# EasyEDA Pro project ZeptoWatch.eprj, schematic Schematic1
Create Date: 2022-11-08; Page Name: P1; Project Name: ZeptoWatch; Schematic Name: Schematic1; Update Date: 2022-11-27; Company: 嘉立创EDA; Page Size: A3; Version: V1.0
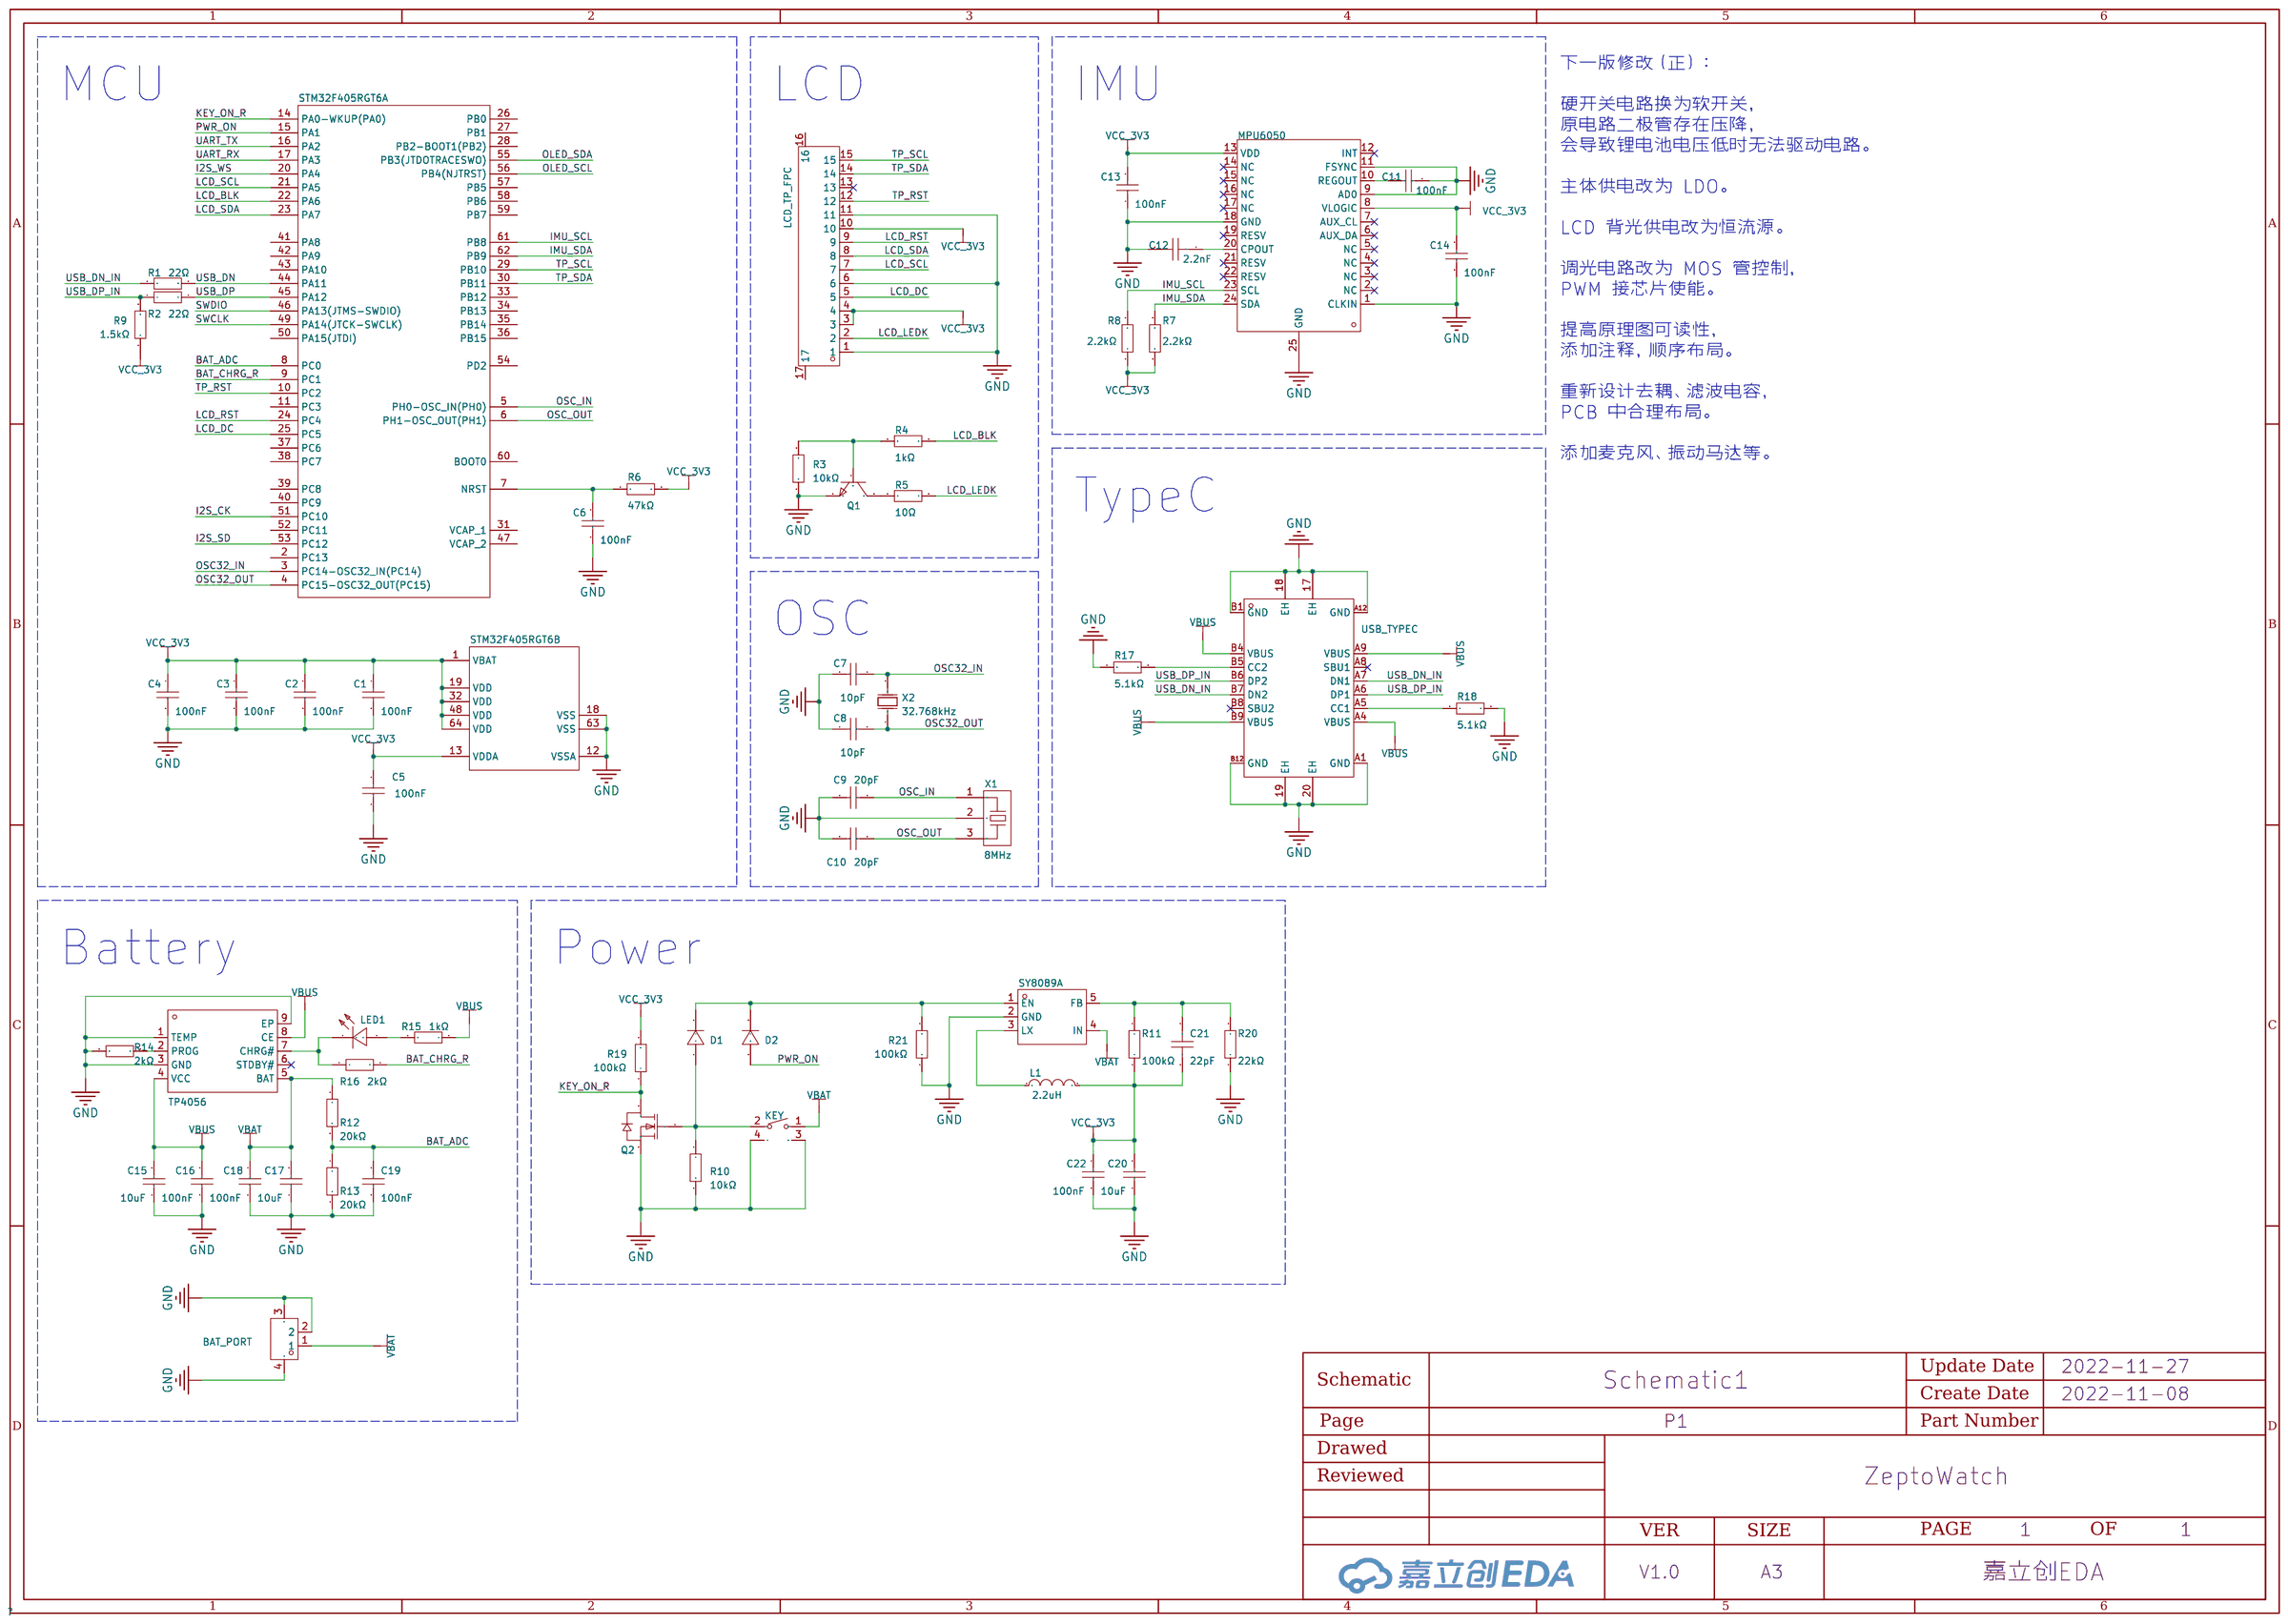
[diagram p0: schematic sheet]

## Parts
BAT_PORT  1.25K-CB-2PWB  [CONN-SMD_2P-P1.25_L5.5-W7.7-2PWB]
C1  100nF  [C0402]
C2  100nF  [C0402]
C3  100nF  [C0402]
C4  100nF  [C0402]
C5  100nF  [C0402]
C6  100nF  [C0402]
C7  10pF  [C0402]
C8  10pF  [C0402]
C9  20pF  [C0402]
C10  20pF  [C0402]
C11  100nF  [C0402]
C12  2.2nF  [C0402]
C13  100nF  [C0402]
C14  100nF  [C0402]
C15  10uF  [C0402]
C16  100nF  [C0402]
C17  10uF  [C0402]
C18  100nF  [C0402]
C19  100nF  [C0402]
C20  10uF  [C0402]
C21  22pF  [C0402]
C22  100nF  [C0402]
D1  B5819WS  [SOD-323_L1.8-W1.3-LS2.5-FD]
D2  B5819WS  [SOD-323_L1.8-W1.3-LS2.5-FD]
KEY  TS-KG012EV  [SW-SMD_TS-KG012EV]
L1  2.2uH  [IND-SMD_L2.5-W2.0_SWPA252012S]
LCD_TP_FPC  KH-FG0.5-H2.0-15PIN  [FPC-SMD_15P-P0.50_KINGHELM_KH-FG0.5-H2.0-15PIN]
LED1  D-060306B1  [LED0603-RD]
MPU6050  MPU-6050  [QFN-24_L4.0-W4.0-P0.50-BL-EP2.7]
Q1  SS8050  [SOT-23-3_L2.9-W1.3-P1.90-LS2.4-BR]
Q2  AO3400A  [SOT-23-3_L2.9-W1.6-P1.90-LS2.8-BR]
R1  22Ω  [R0402]
R2  22Ω  [R0402]
R3  10kΩ  [R0402]
R4  1kΩ  [R0402]
R5  10Ω  [R0402]
R6  47kΩ  [R0402]
R7  2.2kΩ  [R0402]
R8  2.2kΩ  [R0402]
R9  1.5kΩ  [R0402]
R10  10kΩ  [R0402]
R11  100kΩ  [R0402]
R12  20kΩ  [R0402]
R13  20kΩ  [R0402]
R14  2kΩ  [R0402]
R15  1kΩ  [R0402]
R16  2kΩ  [R0402]
R17  5.1kΩ  [R0402]
R18  5.1kΩ  [R0402]
R19  100kΩ  [R0402]
R20  22kΩ  [R0402]
R21  100kΩ  [R0402]
STM32F405RGT6  STM32F405RGT6  [LQFP-64_L10.0-W10.0-P0.50-LS12.0-BL]  (sections 1,2)
SY8089A  SY8089A1AAC  [SOT-23-5_L3.0-W1.7-P0.95-LS2.8-BL]
TP4056  TP4056  [ESOP-8_L4.9-W3.9-P1.27-LS6.0-BL-EP]
USB_TYPEC  TYPE-C-16M-005  [USB-C-SMD_TYPE-C-16M-005]
X1  8MHz  [OSC-SMD_3P-L3.2-W1.3-P1.2-L]
X2  32.768kHz  [OSC-SMD_L3.2-W1.5]

## Library data of the parts
BAT_PORT = 1.25K-CB-2PWB: 参考系列:-;间距:1.25mm;插针结构:1x2P;排数:1;每排PIN数:2;行距:-;公母:公型插针;安装方式:卧贴;额定电流:1A;工作温度范围:-25~+85;; LCSC Part Name: 1x2P 间距P=1.25mm 超薄针座 超薄; Supplier Part: C2919570; Manufacturer: HDGC(华德共创); Supplier Footprint: SMD,P=1.25mm; JLCPCB Part Class: 扩展库; Datasheet: https://atta.szlcsc.com/upload/public/pdf/source/20211115/F776F48743F73668B48ED2809AC4027A.pdf; Supplier: LCSC; Pitch: 1.25mm; Pins Structure: 1x2P; Number of Rows: 1; Number of PINs Per Row: 2; Gender: 公型插针; Mounting Style: 卧贴; Current Rating (Max): 1A; Operating Temperature Range: -25~+85
C1-C6 C11 C13 C14 C16 C18 C19 C22 = CC0402KRX7R9BB104: 容值:100nF;精度:±10%;额定电压:50V;材质(温度系数):X7R;; LCSC Part Name: 100nF ±10% 50V; Supplier Part: C131394; Manufacturer: YAGEO(国巨); Supplier Footprint: 0402; JLCPCB Part Class: 扩展库; Datasheet: https://atta.szlcsc.com/upload/public/pdf/source/20170925/C131394_1506321459057990237.pdf; Supplier: LCSC; Tolerance: ±10%; Voltage Rated: 50V; Temperature Coefficient: X7R
C7 C8 = 0402CG100J500NT: 容值:10pF;精度:±5%;额定电压:50V;材质(温度系数):C0G;; LCSC Part Name: 10pF ±5% 50V; Supplier Part: C1545; Manufacturer: FH(风华); Supplier Footprint: 0402; JLCPCB Part Class: 扩展库; Datasheet: https://atta.szlcsc.com/upload/public/pdf/source/20170923/C1545_1506149264855988352.pdf; Supplier: LCSC; Tolerance: ±5%; Voltage Rated: 50V; Temperature Coefficient: C0G
C9 C10 = 0402CG200J500NT: 温度系数:C0G;容值:20pF;精度:±5%;额定电压:50V;; LCSC Part Name: 20pF(200) ±5% 50V; Supplier Part: C1554; Manufacturer: FH(风华); Supplier Footprint: 0402; JLCPCB Part Class: 基础库; Datasheet: https://atta.szlcsc.com/upload/public/pdf/source/20170923/C1554_1506149268708988361.pdf; Supplier: LCSC; Temperature Coefficient: C0G; Tolerance: ±5%; Voltage Rated: 50V
C12 = CC0402JRX7R9BB222: 温度系数:X7R;容值:2.2nF;电容体长:-;电容体宽:-;电容体厚度:-;精度:±5%;额定电压:50V;; LCSC Part Name: 2.2nF ±5% 50V; Supplier Part: C513667; Manufacturer: YAGEO(国巨); Supplier Footprint: 0402; JLCPCB Part Class: 扩展库; Datasheet: https://atta.szlcsc.com/upload/public/pdf/source/20200415/C513667_43ACA5E3BCCDD816EC65E9B61132137F.pdf; Supplier: LCSC; Temperature Coefficient: X7R; Tolerance: ±5%; Voltage Rated: 50V
C15 C17 C20 = CL05A106MQ5NUNC: 容值:10uF;精度:±20%;额定电压:6.3V;材质(温度系数):X5R;; LCSC Part Name: 10uF ±20% 6.3V; Supplier Part: C15525; Manufacturer: SAMSUNG(三星); Supplier Footprint: 0402; JLCPCB Part Class: 基础库; Datasheet: https://atta.szlcsc.com/upload/public/pdf/source/20220823/2B02EE04F8F211D38A52DCB16EB6BEBA.pdf; Supplier: LCSC; Tolerance: ±20%; Voltage Rated: 6.3V; Temperature Coefficient: X5R
C21 = CC0402GRNPO9BN220: 容值:22pF;精度:±2%;额定电压:50V;温度系数:NP0;; LCSC Part Name: 22pF ±2% 50V; Supplier Part: C541412; Manufacturer: YAGEO(国巨); Supplier Footprint: 0402; JLCPCB Part Class: 扩展库; Datasheet: https://atta.szlcsc.com/upload/public/pdf/source/20200615/C541412_C69BCDCF7FD3EA2053A0CD1B14797F17.pdf; Supplier: LCSC; Tolerance: ±2%; Voltage Rated: 50V; Temperature Coefficient: NP0
D1 D2 = B5819WS_C511873: 直流反向耐压(Vr):40V;平均整流电流(Io):1A;正向压降(Vf):900mV@3A;; LCSC Part Name: 40V 1A 900mV@3A; Supplier Part: C511873; Manufacturer: BORN伯恩半导体; Supplier Footprint: SOD-323; JLCPCB Part Class: 扩展库; Datasheet: https://atta.szlcsc.com/upload/public/pdf/source/20200413/C511871_84C991E4F87F9BC6B00A967897FF2061.pdf; Supplier: LCSC; Reverse Voltage (Vr): 40V; Average Rectified Current (Io): 1A; Forward Voltage (Vf@If): 900mV@3A
KEY = TS-KG012EV: 触点电流:50mA;额定电压(DC):12V;绝缘电阻:100MΩ;电路结构:单刀单掷;安装方式:卧插;按钮形状:矩形按钮;带灯:-;; LCSC Part Name: 轻触开关3*6*3.5侧按卧式 带柱; Supplier Part: C410363; Manufacturer: HANBO(汉博); Supplier Footprint: 插件,7.8x3.6x3.5mm; JLCPCB Part Class: 扩展库; Datasheet: https://atta.szlcsc.com/upload/public/pdf/source/20221110/2C1BC81D53AC7E4C4CC26C5BC87C8C3B.pdf; Supplier: LCSC; Contact Current: 50mA; Voltage Rating (DC): 12V; Insulation Resistance: 100MΩ; Circuit: 单刀单掷; Mounting Style: 卧插; Actuator Style: 矩形按钮
L1 = SWPA252012S2R2NT: 电感值:2.2uH;精度:±30%;额定电流:1.3A;直流电阻(DCR):153mΩ;; LCSC Part Name: 2.2uH ±30% 1.3A 153mΩ; Supplier Part: C36400; Manufacturer: Sunlord(顺络); Supplier Footprint: SMD; JLCPCB Part Class: 扩展库; Datasheet: https://atta.szlcsc.com/upload/public/pdf/source/20210916/AC798BA7E846B7D0B6818F45CD84DB0B.pdf; Supplier: LCSC; Tolerance: ±30%; Rated Current: 1.3A; DC Resistance (DCR): 153mΩ
LCD_TP_FPC = KH-FG0.5-H2.0-15PIN: 间距:0.5mm;触点数量:15;锁定特性:翻盖式;安装类型:卧贴;触点类型:下接;工作温度范围:-25~+85;; LCSC Part Name: 0.5mm P数:15 翻盖式 下接; Supplier Part: C2925370; Manufacturer: kinghelm(金航标); Supplier Footprint: SMD,P=0.5mm; JLCPCB Part Class: 扩展库; Datasheet: https://atta.szlcsc.com/upload/public/pdf/source/20211126/ADAA9B198F87BAF60DF8D38208290934.pdf; Supplier: LCSC; Pitch: 0.5mm; Number of Contacts: 15; Locking Feature: 翻盖式; Mounting Type: 卧贴; Contact Type: 下接; Height Above Board: 2mm; FFC, FCB Thickness: 0.3mm; Operating Temperature Range: -25~+85
LED1 = D-060306B1: 发光颜色:蓝灯;; LCSC Part Name: 蓝色; Supplier Part: C118339; Manufacturer: 方舟 ARKLED; Supplier Footprint: 0603; JLCPCB Part Class: 扩展库; Datasheet: https://atta.szlcsc.com/upload/public/pdf/source/20190902/C118339_0F376D9FE53277D0A68A27C8339FB377.pdf; Supplier: LCSC; Emitted Color: 蓝灯
MPU6050 = MPU-6050: 三轴加速度计和三轴陀螺仪，工作电压：2.375V~3.46V; Supplier Part: C24112; Manufacturer: TDK InvenSense(应美盛); Supplier Footprint: QFN-24_4x4x05P; JLCPCB Part Class: 扩展库; Datasheet: https://atta.szlcsc.com/upload/public/pdf/source/20140425/1457707046159.pdf; Supplier: LCSC
Q1 = SS8050_C2150: 晶体管类型:NPN;集射极击穿电压(Vceo):25V;集电极电流(Ic):1.5A;功率(Pd):300mW;集电极-发射极饱和电压(VCE(sat)@Ic,Ib):500mV@800mA,80mA;直流电流增益(hFE@Ic,Vce):200@100mA,1V;特征频率(fT):100MHz;工作温度:+150@(Tj);; LCSC Part Name: SS8050 Y1 200-350 Y1 200-350; Supplier Part: C2150; Manufacturer: CJ(江苏长电/长晶); Supplier Footprint: SOT-23(SOT-23-3); JLCPCB Part Class: 基础库; Datasheet: https://atta.szlcsc.com/upload/public/pdf/source/20140809/1457707209319.pdf; Supplier: LCSC; Transistor Type: NPN; Collector-Emitter Breakdown Voltage (Vceo): 25V; Collector Current (Ic): 1.5A; Power Dissipation (Pd): 300mW; Collector-Emitter Saturation Voltage (VCE(sat)@Ic,Ib): 500mV@800mA,80mA; DC Current Gain (hFE@Ic,Vce): 200@100mA,1V; Transition Frequency (fT): 100MHz; Operating Temperature: +150@(Tj)
Q2 = AO3400A_C20917: 类型:N沟道;漏源电压(Vdss):30V;连续漏极电流(Id):5.7A;功率(Pd):1.4W;导通电阻(RDS(on)@Vgs,Id):26.5mΩ@10V,5.7A;阈值电压(Vgs(th)@Id):1.5V@250A;; LCSC Part Name: N沟道 30V 5.7A; Supplier Part: C20917; Manufacturer: AOS; Supplier Footprint: SOT-23-3L; JLCPCB Part Class: 基础库; Datasheet: https://atta.szlcsc.com/upload/public/pdf/source/20140107/1457706668533.pdf; Supplier: LCSC; Type: N沟道; Drain Source Voltage (Vdss): 30V; Continuous Drain Current (Id): 5.7A; Power Dissipation (Pd): 1.4W; Drain Source On Resistance (RDS(on)@Vgs,Id): 26.5mΩ@10V,5.7A; Gate Threshold Voltage (Vgs(th)@Id): 1.5V@250A
R1 R2 = CR0402FF22R0G: 电阻类型:厚膜电阻;阻值:22Ω;精度:±1%;功率:1/16W;温度系数:±200ppm/;最大工作电压:50V;工作温度范围:-55~+125;; LCSC Part Name: 22Ω ±1%; Supplier Part: C100318; Manufacturer: LIZ(丽智电子); Supplier Footprint: 0402; Datasheet: https://atta.szlcsc.com/upload/public/pdf/source/20170408/1491621411980.pdf; Supplier: LCSC; Type: 厚膜电阻; Tolerance: ±1%; Power(Watts): 1/16W; Temperature Coefficient: ±200ppm/; Overload Voltage (Max): 50V; Operating Temperature Range: -55~+125
R3 R10 = 0402WGF1002TCE: 电阻类型:厚膜电阻;阻值:10kΩ;精度:±1%;功率:62.5mW;温度系数:±100ppm/;最大工作电压:50V;工作温度范围:-55~+155;; LCSC Part Name: 10kΩ ±1% 62.5mW; Supplier Part: C25744; Manufacturer: UNI-ROYAL(厚声); Supplier Footprint: 0402; JLCPCB Part Class: 基础库; Datasheet: https://atta.szlcsc.com/upload/public/pdf/source/20200306/C422600_1E6D84923E4A46A82E41ADD87F860B5C.pdf; Supplier: LCSC; Type: 厚膜电阻; Tolerance: ±1%; Power(Watts): 62.5mW; Temperature Coefficient: ±100ppm/; Overload Voltage (Max): 50V; Operating Temperature Range: -55~+155
R4 R15 = 0402WGF1001TCE: 电阻类型:厚膜电阻;阻值:1kΩ;精度:±1%;功率:62.5mW;温度系数:±100ppm/;最大工作电压:50V;工作温度范围:-55~+155;; LCSC Part Name: 1kΩ ±1% 62.5mW; Supplier Part: C11702; Manufacturer: UNI-ROYAL(厚声); Supplier Footprint: 0402; JLCPCB Part Class: 基础库; Datasheet: https://atta.szlcsc.com/upload/public/pdf/source/20200306/C422600_1E6D84923E4A46A82E41ADD87F860B5C.pdf; Supplier: LCSC; Type: 厚膜电阻; Tolerance: ±1%; Power(Watts): 62.5mW; Temperature Coefficient: ±100ppm/; Overload Voltage (Max): 50V; Operating Temperature Range: -55~+155
R5 = 0402WGF100JTCE: 精度:±1%;温度系数:±200ppm/;功率:1/16W;阻值:10Ω;最大工作电压:50V;工作温度范围:-55~+155;; LCSC Part Name: 10Ω ±1%; Supplier Part: C25077; Manufacturer: UNI-ROYAL(厚声); Supplier Footprint: 0402; JLCPCB Part Class: 基础库; Datasheet: https://atta.szlcsc.com/upload/public/pdf/source/20170920/C25077_1505901198079982708.pdf; Supplier: LCSC; Tolerance: ±1%; Temperature Coefficient: ±200ppm/; Power(Watts): 1/16W; Overload Voltage (Max): 50V; Operating Temperature Range: -55~+155
R6 = 0402WGF4702TCE: 电阻类型:厚膜电阻;阻值:47kΩ;精度:±1%;功率:62.5mW;温度系数:±100ppm/;最大工作电压:50V;工作温度范围:-55~+155;; LCSC Part Name: 47kΩ ±1% 62.5mW; Supplier Part: C25792; Manufacturer: UNI-ROYAL(厚声); Supplier Footprint: 0402; JLCPCB Part Class: 基础库; Datasheet: https://atta.szlcsc.com/upload/public/pdf/source/20200306/C422600_1E6D84923E4A46A82E41ADD87F860B5C.pdf; Supplier: LCSC; Type: 厚膜电阻; Tolerance: ±1%; Power(Watts): 62.5mW; Temperature Coefficient: ±100ppm/; Overload Voltage (Max): 50V; Operating Temperature Range: -55~+155
R7 R8 = RMC04022.2K5%N: 阻值:2.2kΩ;精度:±5%;功率:1/16W;; LCSC Part Name: 2.2kΩ ±5%; Supplier Part: C269678; Manufacturer: Tyohm(幸亚电阻); Supplier Footprint: 0402; JLCPCB Part Class: 扩展库; Datasheet: https://atta.szlcsc.com/upload/public/pdf/source/20190115/C269678_CFD168C224D6BF2B41E71AA235945392.pdf; Supplier: LCSC; Tolerance: ±5%; Power(Watts): 1/16W
R9 = 0402WGF1501TCE: 阻值:1.5kΩ;精度:±1%;功率:1/16W;温度系数:±100ppm/;最大工作电压:50V;工作温度范围:-55~+155;; LCSC Part Name: 1.5KΩ ±1%; Supplier Part: C25867; Manufacturer: UNI-ROYAL(厚声); Supplier Footprint: 0402; JLCPCB Part Class: 基础库; Datasheet: https://atta.szlcsc.com/upload/public/pdf/source/20170920/C25867_1505895090394980874.pdf; Supplier: LCSC; Tolerance: ±1%; Power(Watts): 1/16W; Temperature Coefficient: ±100ppm/; Overload Voltage (Max): 50V; Operating Temperature Range: -55~+155
R11 R19 R21 = AC0402FR-07100KL: 电阻类型:厚膜电阻;阻值:100kΩ;精度:±1%;功率:62.5mW;温度系数:±100ppm/;最大工作电压:50V;工作温度范围:-55~+155;; LCSC Part Name: 100kΩ ±1%; Supplier Part: C144809; Manufacturer: YAGEO(国巨); Supplier Footprint: 0402; JLCPCB Part Class: 扩展库; Datasheet: https://atta.szlcsc.com/upload/public/pdf/source/20171225/C144809_15141880836601203001.pdf; Supplier: LCSC; Type: 厚膜电阻; Tolerance: ±1%; Power(Watts): 62.5mW; Temperature Coefficient: ±100ppm/; Overload Voltage (Max): 50V; Operating Temperature Range: -55~+155
R12 R13 = RC-02W203JT: 阻值:20kΩ;精度:±5%;功率:62.5mW;温度系数:±200ppm/;最大工作电压:50V;工作温度范围:-55~+155;; LCSC Part Name: 20kΩ ±5% 62.5mW; Supplier Part: C258120; Manufacturer: FH(风华); Supplier Footprint: 0402; JLCPCB Part Class: 扩展库; Datasheet: https://atta.szlcsc.com/upload/public/pdf/source/20180730/C258120_EB2ABA5B79561D80B536831B08AD21D8.pdf; Supplier: LCSC; Tolerance: ±5%; Power(Watts): 62.5mW; Temperature Coefficient: ±200ppm/; Overload Voltage (Max): 50V; Operating Temperature Range: -55~+155
R14 R16 = WR04X202JTL: 精度:±5%;阻值:2kΩ;功率:1/16W;温度系数:±100ppm/;最大工作电压:50V;工作温度范围:-55~+155;; LCSC Part Name: 2kΩ ±5%; Supplier Part: C168256; Manufacturer: Walsin(华新科); Supplier Footprint: 0402; JLCPCB Part Class: 扩展库; Datasheet: https://atta.szlcsc.com/upload/public/pdf/source/20180228/C168256_15198055032591377457.pdf; Supplier: LCSC; Tolerance: ±5%; Power(Watts): 1/16W; Temperature Coefficient: ±100ppm/; Overload Voltage (Max): 50V; Operating Temperature Range: -55~+155
R17 R18 = RC0402FR-075K1L: 阻值:5.1kΩ;精度:±1%;功率:62.5mW;温度系数:±100ppm/;最大工作电压:50V;工作温度范围:-55~+155;; LCSC Part Name: 5.1kΩ ±1% 62.5mW; Supplier Part: C105872; Manufacturer: YAGEO(国巨); Supplier Footprint: 0402; JLCPCB Part Class: 扩展库; Datasheet: https://atta.szlcsc.com/upload/public/pdf/source/20170912/C105872_1505207464555963229.pdf; Supplier: LCSC; Tolerance: ±1%; Power(Watts): 62.5mW; Temperature Coefficient: ±100ppm/; Overload Voltage (Max): 50V; Operating Temperature Range: -55~+155
R20 = AC0402FR-0722KL: 电阻类型:厚膜电阻;阻值:22kΩ;精度:±1%;功率:62.5mW;温度系数:±100ppm/;最大工作电压:50V;工作温度范围:-55~+155;; LCSC Part Name: 22kΩ ±1%; Supplier Part: C144778; Manufacturer: YAGEO(国巨); Supplier Footprint: 0402; JLCPCB Part Class: 扩展库; Datasheet: https://atta.szlcsc.com/upload/public/pdf/source/20171221/C144778_15138311752841195398.pdf; Supplier: LCSC; Type: 厚膜电阻; Tolerance: ±1%; Power(Watts): 62.5mW; Temperature Coefficient: ±100ppm/; Overload Voltage (Max): 50V; Operating Temperature Range: -55~+155
STM32F405RGT6 = STM32F405RGT6: 主频（MAX):168MHz;工作电压:1.8V ~ 3.6V;; Supplier Part: C15742; Manufacturer: ST(意法半导体); Supplier Footprint: LQFP-64_10x10x05P; JLCPCB Part Class: 扩展库; Datasheet: https://atta.szlcsc.com/upload/public/pdf/source/20140724/1457707160365.pdf; Supplier: LCSC; Speed: 168MHz; Voltage - Supply (Vcc/Vdd): 1.8V ~ 3.6V; Program Memory Size: 1MB; RAM Size: 192KB; Number of I/O: 51; A/D: 16x12bit; D/A: 2x12bit; PWM: 56; LCD: MOTOROLA 6800 AND INTEL  8080 TYPE LCD DIRECTLY; UART/USART: 4 USART+2 UART; SPI: 3; I2C（SMBUS/PMBUS）: 3; USB Device: 1; USB Host/OTG: 1; CAN: 2
SY8089A = SY8089A1AAC: Supplier Part: C479074; Manufacturer: 矽力杰silergy; Supplier Footprint: SOT-23-5; JLCPCB Part Class: 扩展库; Datasheet: https://atta.szlcsc.com/upload/public/pdf/source/20200117/C479074_09E605B8BDE11DB5A08573B7E6429A0D.pdf; Supplier: LCSC
TP4056 = TP4056_C382139: LCSC Part Name: 1A锂电池充电IC; Supplier Part: C382139; Manufacturer: TPOWER(天源); Supplier Footprint: ESOP-8; JLCPCB Part Class: 扩展库; Datasheet: https://atta.szlcsc.com/upload/public/pdf/source/20190327/C382139_EC85960E6FE3E26856C240C81751A184.pdf; Supplier: LCSC
USB_TYPEC = TYPE-C-16M-005: 连接器类型:-;标准:-;公母:-;触点数量:-;端口数量:-;安装方式:-;额定电流 - 电源:-;触头材质:-;触头镀层:-;工作温度范围:-;; Supplier Part: C2798173; Manufacturer: USAKRO(美韩); Supplier Footprint: SMD; Datasheet: https://atta.szlcsc.com/upload/public/pdf/source/20210415/C2798173_AFB22F19D04D65557371BF612B0225CF.pdf; Supplier: LCSC
X1 = CSTCE8M00G15C99-R0: 频率:8MHz;频率容差:±0.1%;内藏负载电容:33pF;谐振阻抗:40Ω;; LCSC Part Name: 8M ±0.1% 33pF; Supplier Part: C110614; Manufacturer: muRata(村田); Supplier Footprint: SMD3213-3P; JLCPCB Part Class: 扩展库; Datasheet: https://atta.szlcsc.com/upload/public/pdf/source/20180327/C110614_9F5031E08ADB10DE4472527BF78A8CAF.pdf; Supplier: LCSC; Frequency Stability: ±0.13%; Frequency Tolerance: ±0.1%; Built-in Load Capacitance: 33pF; Resonant Impedance: 40Ω; Operating Temperature: -40~+125
X2 = X1A000141000300: 晶振类型:贴片无源晶振;频率:32.768kHz;频率公差:±20ppm;负载电容:12.5pF;等效串联电阻(ESR):-;工作温度:-40~+85;; LCSC Part Name: 32.768kHz ±20ppm 12.5pF; Supplier Part: C94276; Manufacturer: EPSON(爱普生); Supplier Footprint: SMD3215-2P; JLCPCB Part Class: 扩展库; Datasheet: https://atta.szlcsc.com/upload/public/pdf/source/20190322/C94276_5F77F140A1A8611EFF35496F1E5C1546.pdf; Supplier: LCSC; Crystal Type: 贴片无源晶振; Frequency Tolerance: ±20ppm; Load Capacitance: 12.5pF; Operating Temperature: -40~+85

## Nets
GND: BAT_PORT.2 BAT_PORT.3 BAT_PORT.4 C1.2 C2.2 C3.2 C4.2 C5.1 C6.1 C7.1 C8.1 C9.1 C10.1 C11.2 C12.2 C13.1 C14.1 C15.1 C16.2 C17.1 C18.2 C19.2 C20.1 C22.2 KEY.3 KEY.4 LCD_TP_FPC.1 LCD_TP_FPC.6 LCD_TP_FPC.11 MPU6050.1(CLKIN) MPU6050.9(AD0) MPU6050.11(FSYNC) MPU6050.18(GND) MPU6050.25(GND) Q1.2(E) Q2.2(S) R3.2 R10.2 R13.2 R14.1 R17.1 R18.2 R20.1 R21.1 STM32F405RGT6.12(VSSA) STM32F405RGT6.18(VSS) STM32F405RGT6.63(VSS) SY8089A.2(GND) TP4056.1(TEMP) TP4056.3(GND) TP4056.9(EP) USB_TYPEC.17(EH) USB_TYPEC.18(EH) USB_TYPEC.19(EH) USB_TYPEC.20(EH) USB_TYPEC.A1(GND) USB_TYPEC.A12(GND) USB_TYPEC.B1(GND) USB_TYPEC.B12(GND) X1.2
VBAT: BAT_PORT.1 C17.2 C18.1 KEY.1 R12.1 SY8089A.4(IN) TP4056.5(BAT)
VBUS: C15.2 C16.1 R15.1 TP4056.4(VCC) TP4056.8(CE) USB_TYPEC.A4(VBUS) USB_TYPEC.A9(VBUS) USB_TYPEC.B4(VBUS) USB_TYPEC.B9(VBUS)
VCC_3V3: C1.1 C2.1 C3.1 C4.1 C5.2 C13.2 C14.2 C20.2 C21.1 C22.1 L1.2 LCD_TP_FPC.3 LCD_TP_FPC.4 LCD_TP_FPC.10 MPU6050.8(VLOGIC) MPU6050.13(VDD) R6.2 R7.1 R8.1 R9.1 R11.1 R19.2 STM32F405RGT6.1(VBAT) STM32F405RGT6.13(VDDA) STM32F405RGT6.19(VDD) STM32F405RGT6.32(VDD) STM32F405RGT6.48(VDD) STM32F405RGT6.64(VDD)
BAT_ADC: C19.1 R12.2 R13.1 STM32F405RGT6.8(PC0)
BAT_CHRG_R: R16.2 STM32F405RGT6.9(PC1)
I2S_CK: STM32F405RGT6.51(PC10)
I2S_SD: STM32F405RGT6.53(PC12)
I2S_WS: STM32F405RGT6.20(PA4)
IMU_SCL: MPU6050.23(SCL) R8.2 STM32F405RGT6.61(PB8)
IMU_SDA: MPU6050.24(SDA) R7.2 STM32F405RGT6.62(PB9)
KEY_ON_R: Q2.3(D) R19.1 STM32F405RGT6.14(PA0-WKUP(PA0))
LCD_BLK: R4.1 STM32F405RGT6.22(PA6)
LCD_DC: LCD_TP_FPC.5 STM32F405RGT6.25(PC5)
LCD_LEDK: LCD_TP_FPC.2 R5.2
LCD_RST: LCD_TP_FPC.9 STM32F405RGT6.24(PC4)
LCD_SCL: LCD_TP_FPC.7 STM32F405RGT6.21(PA5)
LCD_SDA: LCD_TP_FPC.8 STM32F405RGT6.23(PA7)
OLED_SCL: STM32F405RGT6.56(PB4(NJTRST))
OLED_SDA: STM32F405RGT6.55(PB3(JTDOTRACESWO))
OSC32_IN: C7.2 STM32F405RGT6.3(PC14-OSC32_IN(PC14)) X2.2(OSC2)
OSC32_OUT: C8.2 STM32F405RGT6.4(PC15-OSC32_OUT(PC15)) X2.1(OSC1)
OSC_IN: C9.2 STM32F405RGT6.5(PH0-OSC_IN(PH0)) X1.1
OSC_OUT: C10.2 STM32F405RGT6.6(PH1-OSC_OUT(PH1)) X1.3
PWR_ON: D2.1(A) STM32F405RGT6.15(PA1)
SWCLK: STM32F405RGT6.49(PA14(JTCK-SWCLK))
SWDIO: STM32F405RGT6.46(PA13(JTMS-SWDIO))
TP_RST: LCD_TP_FPC.12 STM32F405RGT6.10(PC2)
TP_SCL: LCD_TP_FPC.15 STM32F405RGT6.29(PB10)
TP_SDA: LCD_TP_FPC.14 STM32F405RGT6.30(PB11)
UART_RX: STM32F405RGT6.17(PA3)
UART_TX: STM32F405RGT6.16(PA2)
USB_DN: R1.2 STM32F405RGT6.44(PA11)
USB_DN_IN: R1.1 USB_TYPEC.A7(DN1) USB_TYPEC.B7(DN2)
USB_DP: R2.2 STM32F405RGT6.45(PA12)
USB_DP_IN: R2.1 R9.2 USB_TYPEC.A6(DP1) USB_TYPEC.B6(DP2)
$1N9238: Q1.3(C) R5.1
$1N9425: Q1.1(B) R3.1 R4.2
$1N15962: C11.1 MPU6050.10(REGOUT)
$1N17008: C12.1 MPU6050.20(CPOUT)
$1N32778: R14.2 TP4056.2(PROG)
$1N37022: LED1.2 R15.2
$1N38725: LED1.1 R16.1 TP4056.7(CHRG#)
$1N43806: R17.2 USB_TYPEC.B5(CC2)
$1N44125: R18.1 USB_TYPEC.A5(CC1)
$1N53709: D1.1(A) KEY.2 Q2.1(G) R10.1
$1N56463: D1.2(K) D2.2(K) R21.2 SY8089A.1(EN)
$1N59957: L1.1 SY8089A.3(LX)
$1N60626: C21.2 R11.2 R20.2 SY8089A.5(FB)
Net-(C6-2): C6.2 R6.1 STM32F405RGT6.7(NRST)

Not connected (* = marked no-connect by the designer): LCD_TP_FPC 13* 16 17; MPU6050 2(NC)* 3(NC)* 4(NC)* 5(NC)* 6(AUX_DA)* 7(AUX_CL)* 12(INT)* 14(NC)* 15(NC)* 16(NC)* 17(NC)* 19(RESV)* 21(RESV)* 22(RESV)*; STM32F405RGT6 2(PC13) 11(PC3) 26(PB0) 27(PB1) 28(PB2-BOOT1(PB2)) 31(VCAP_1) 33(PB12) 34(PB13) 35(PB14) 36(PB15) 37(PC6) 38(PC7) 39(PC8) 40(PC9) 41(PA8) 42(PA9) 43(PA10) 47(VCAP_2) 50(PA15(JTDI)) 52(PC11) 54(PD2) 57(PB5) 58(PB6) 59(PB7) 60(BOOT0); TP4056 6(STDBY#)*; USB_TYPEC A8(SBU1)* B8(SBU2)*

## Notes on the sheet
- 下一版修改（正）：
  硬开关电路换为软开关，
  原电路二极管存在压降，
  会导致锂电池电压低时无法驱动电路。
  主体供电改为 LDO。
  LCD 背光供电改为恒流源。
  调光电路改为 MOS 管控制，
  PWM 接芯片使能。
  提高原理图可读性，
  添加注释，顺序布局。
  重新设计去耦、滤波电容，
  PCB 中合理布局。
  添加麦克风、振动马达等。
- MCU
- LCD
- IMU
- TypeC
- OSC
- Battery
- Power
